# Altium schematic sheet Mako DSP USB.SchDoc
size A
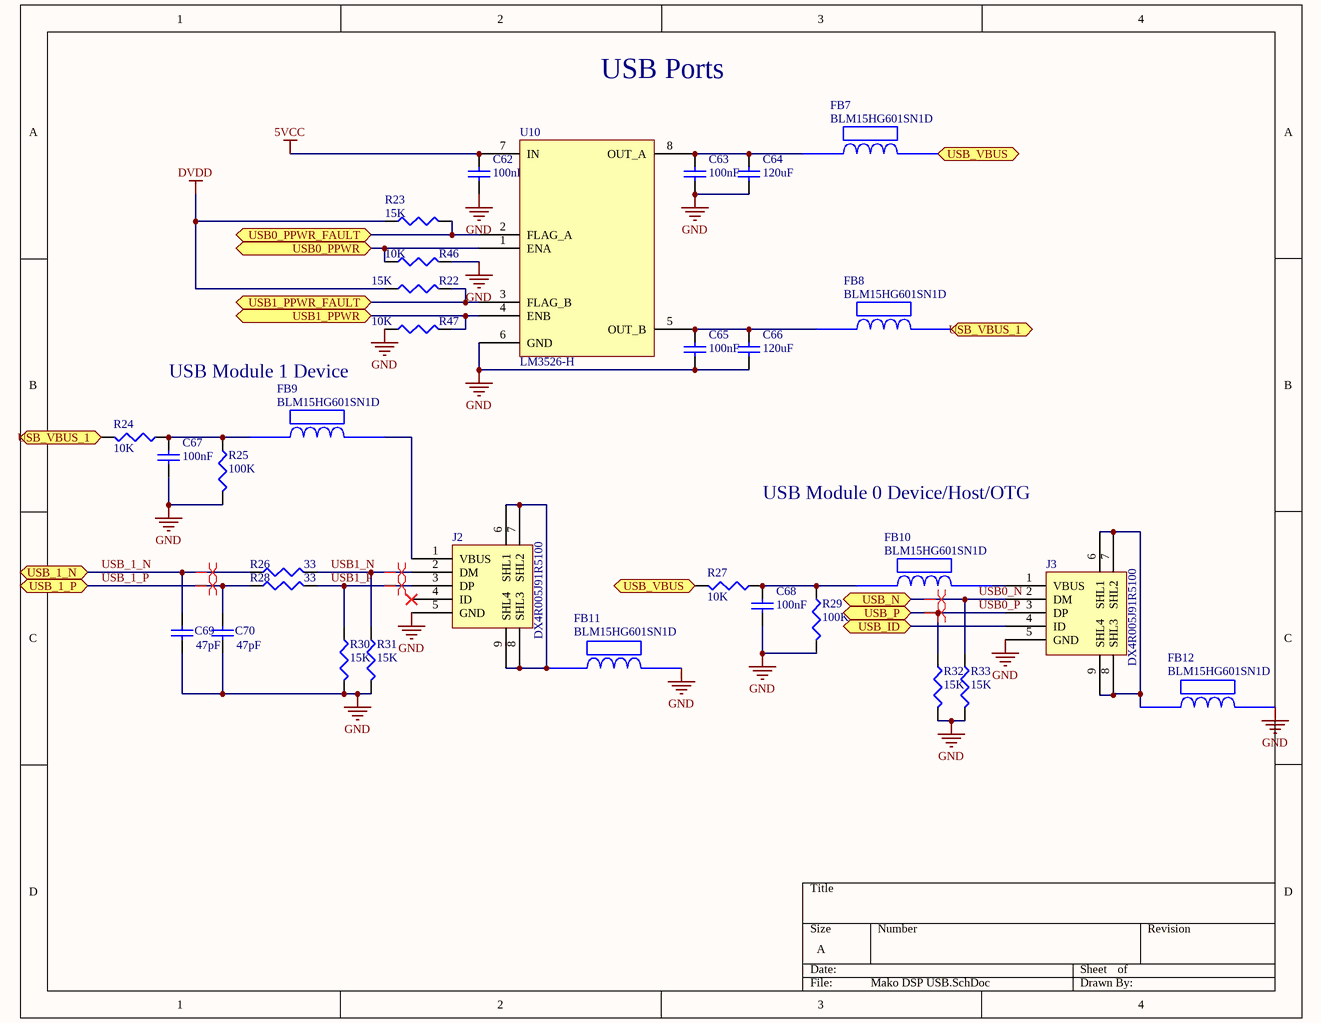
[diagram p0: Mako DSP USB.SchDoc]

## Parts
C62  value 100nF  [1608[0603]]  (hidden comment: Cap Semi)
C63  value 100nF  [1608[0603]]  (hidden comment: Cap Semi)
C64  value 120uF  [1608[0603]]  (hidden comment: Cap Semi)
C65  value 100nF  [1608[0603]]  (hidden comment: Cap Semi)
C66  value 120uF  [1608[0603]]  (hidden comment: Cap Semi)
C67  value 100nF  [1608[0603]]  (hidden comment: Cap Semi)
C68  value 100nF  [1608[0603]]  (hidden comment: Cap Semi)
C69  value 47pF  [1608[0603]]  (hidden comment: Cap Semi)
C70  value 47pF  [1608[0603]]  (hidden comment: Cap Semi)
FB7  BLM15HG601SN1D  [BLM18PG121SN1D]
FB8  BLM15HG601SN1D  [BLM18PG121SN1D]
FB9  BLM15HG601SN1D  [BLM18PG121SN1D]
FB10  BLM15HG601SN1D  [BLM18PG121SN1D]
FB11  BLM15HG601SN1D  [BLM18PG121SN1D]
FB12  BLM15HG601SN1D  [BLM18PG121SN1D]
J2  DX4R005J91R5100  [Micro USB Circular Holes Only]
J3  DX4R005J91R5100  [Micro USB Circular Holes Only]
R22  value 15K  [J1-0603]  (hidden comment: Res3)
R23  value 15K  [J1-0603]  (hidden comment: Res3)
R24  value 10K  [J1-0603]  (hidden comment: Res3)
R25  value 100K  [J1-0603]  (hidden comment: Res3)
R26  value 33  [J1-0603]  (hidden comment: Res3)
R27  value 10K  [J1-0603]  (hidden comment: Res3)
R28  value 33  [J1-0603]  (hidden comment: Res3)
R29  value 100K  [J1-0603]  (hidden comment: Res3)
R30  value 15K  [J1-0603]  (hidden comment: Res3)
R31  value 15K  [J1-0603]  (hidden comment: Res3)
R32  value 15K  [J1-0603]  (hidden comment: Res3)
R33  value 15K  [J1-0603]  (hidden comment: Res3)
R46  value 10K  [J1-0603]  (hidden comment: Res3)
R47  value 10K  [J1-0603]  (hidden comment: Res3)
U10  LM3526-H  [LM3526]

## Ports
USB0_PPWR (bidir), USB0_PPWR_FAULT (bidir), USB1_PPWR (bidir), USB1_PPWR_FAULT (bidir), USB_1_N (bidir), USB_1_P (bidir), USB_ID (bidir), USB_N (bidir), USB_P (bidir), USB_VBUS (bidir), USB_VBUS_1 (bidir)

## Nets
5VCC: C62.2 U10.7(IN)
DVDD: R22.1 R23.1
GND: C62.1 C63.1 C64.1 C65.1 C66.1 C67.1 C68.1 C69.1 C70.1 FB11.2 FB12.2 J2.5(GND) J3.5(GND) R25.2 R29.2 R30.2 R31.2 R32.2 R33.2 R46.2 R47.1 U10.6(GND)
USB0_N: J3.2(DM) R33.1 ; port USB_N
USB0_P: J3.3(DP) R32.1 ; port USB_P
USB0_PPWR: R46.1 U10.1(ENA) ; port USB0_PPWR
USB0_PPWR_FAULT: R23.2 U10.2(FLAG_A) ; port USB0_PPWR_FAULT
USB1_N: J2.2(DM) R26.2 R31.1
USB1_P: J2.3(DP) R28.2 R30.1
USB1_PPWR: R47.2 U10.4(ENB) ; port USB1_PPWR
USB1_PPWR_FAULT: R22.2 U10.3(FLAG_B) ; port USB1_PPWR_FAULT
USB_1_N: C69.2 R26.1 ; port USB_1_N
USB_1_P: C70.2 R28.1 ; port USB_1_P
USB_ID: J3.4(ID) ; port USB_ID
USB_VBUS: FB7.2 R27.2 ; port USB_VBUS
USB_VBUS_1: FB8.2 R24.2 ; port USB_VBUS_1
NetC63_2: C63.2 C64.2 FB7.1 U10.8(OUT_A)
NetC65_2: C65.2 C66.2 FB8.1 U10.5(OUT_B)
NetC67_2: C67.2 FB9.1 R24.1 R25.1
NetC68_2: C68.2 FB10.1 R27.1 R29.1
NetFB9_2: FB9.2 J2.1(VBUS)
NetFB10_2: FB10.2 J3.1(VBUS)
NetFB11_1: FB11.1 J2.6(SHL1) J2.7(SHL2) J2.8(SHL3) J2.9(SHL4)
NetFB12_1: FB12.1 J3.6(SHL1) J3.7(SHL2) J3.8(SHL3) J3.9(SHL4)

Not connected (* = marked no-connect by the designer): J2 4(ID)*

## Layout directives
differential pair: USB0_N, USB0_P, USB1_N, USB1_P, USB_1_N, USB_1_P

## Notes on the sheet
- USB Ports
- USB Module 1 Device
- USB Module 0 Device/Host/OTG

## Library data of the parts
C62-C70 = Cap Semi: Capacitor (Semiconductor SIM Model); Published: 8-Jun-2000; LatestRevisionDate: 29-May-2009; LatestRevisionNote: IPC-7351 Footprint Added.; PackageReference: C1206; Publisher: Altium Limited; PackageDescription: Chip Capacitor
J2 J3 = Micro USB: Micro USB Jack B
R22-R33 R46 R47 = Res3: Resistor; Published: 8-Jun-2000; LatestRevisionDate: 29-May-2009; LatestRevisionNote: IPC-7351 Footprint Added.; PackageReference: J1-0603; Publisher: Altium Limited; PackageDescription: Chip Resistor
U10 = LM3526